# Altium project Back Row.PrjPcb
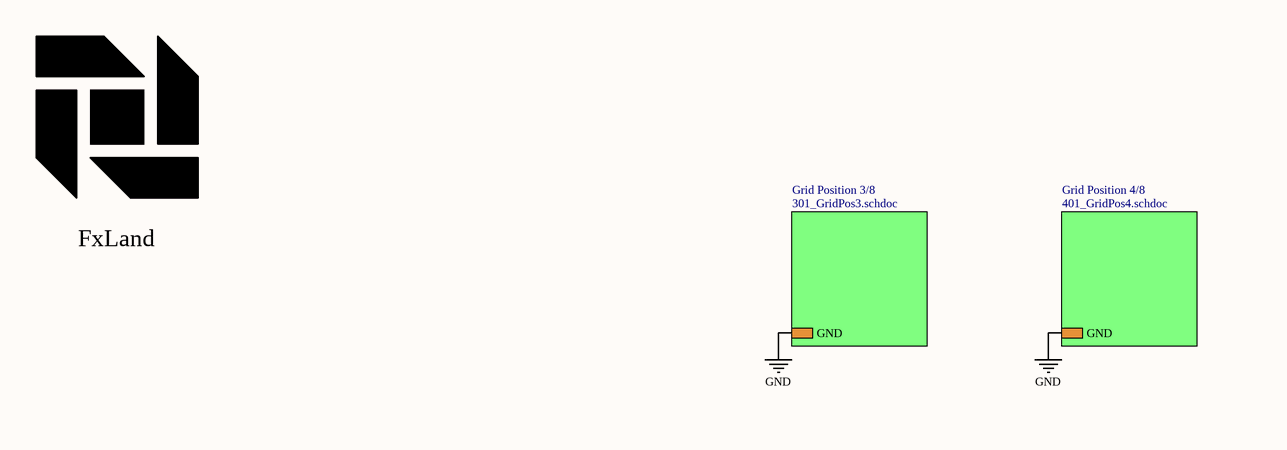
[diagram p0: 001_top.SchDoc, left]
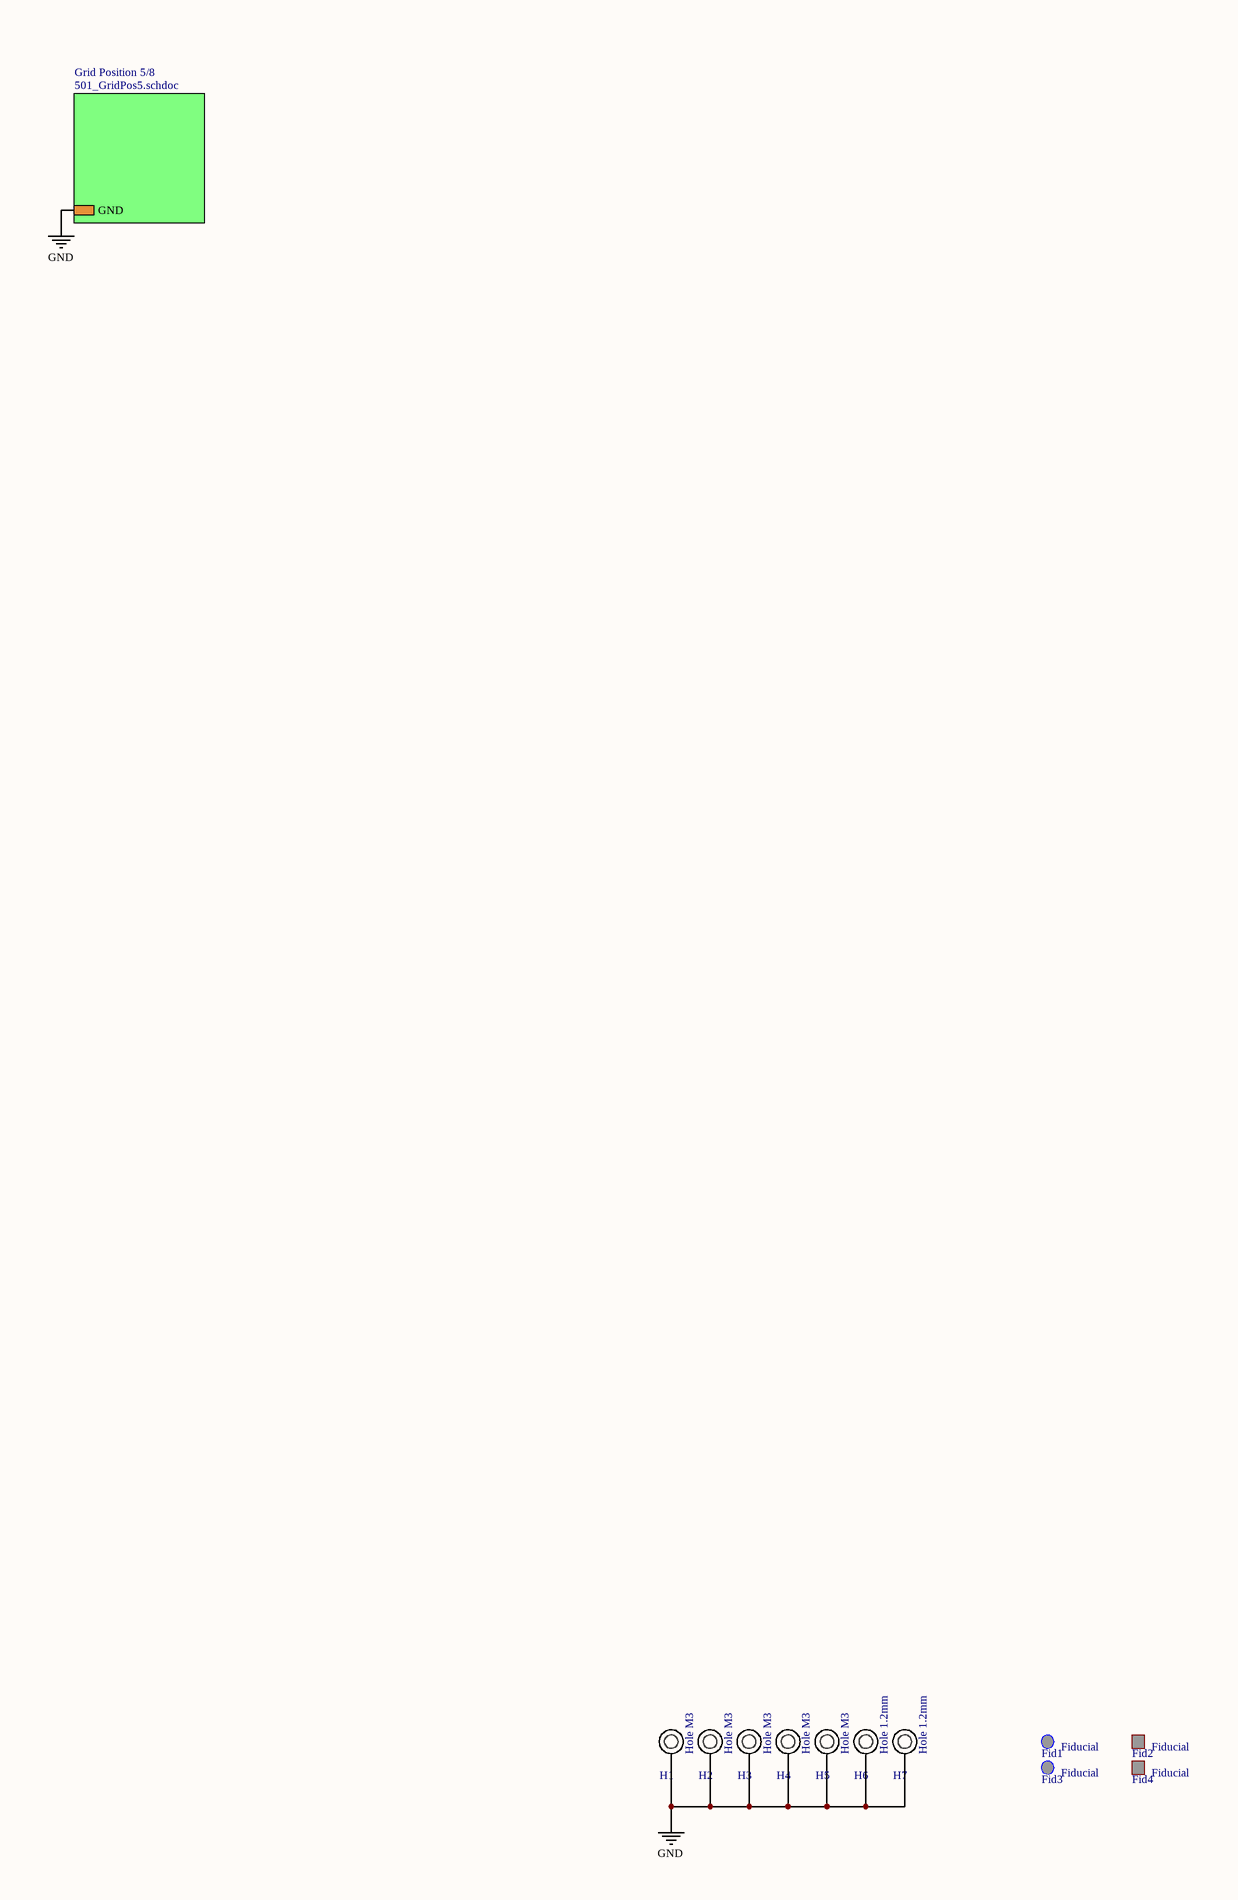
[diagram p1: 001_top.SchDoc, right]
DocNumber: P234; Rev: 1.8
4 sheets, 18 parts. Net scope: hierarchical (ports join the sheet entries above them; power ports are global).
Board file: Back Row.PcbDoc
Sheets:
  001_top.SchDoc
    Grid Position 4/8 = 401_GridPos4.SchDoc
    Grid Position 5/8 = 501_GridPos5.SchDoc
    Grid Position 3/8 = 301_GridPos3.SchDoc

## Sheet 001_top.SchDoc
size A2; Organization: Greenfield Tech Solutions; Address1: Molendreef 33; Address2: Ossendrecht; Address3: 4641CS; Address4: The Netherlands; DocumentNumber: P234; Revision: 1.8; SheetNumber: 1; SheetTotal: 4

### Parts
Fid1  Fiducial  [FidR_1.0mm]
Fid2  Fiducial  [FidS_1.0mm]
Fid3  Fiducial  [FidR_1.0mm]
Fid4  Fiducial  [FidS_1.0mm]
H1  Hole M3  [HOLE_M3]
H2  Hole M3  [HOLE_M3]
H3  Hole M3  [HOLE_M3]
H4  Hole M3  [HOLE_M3]
H5  Hole M3  [HOLE_M3]
H6  Hole 1.2mm  [HOLE_1.2MM]
H7  Hole 1.2mm  [HOLE_1.2MM]
Logo_FxLand1  FxLand  [Logo_FxLand_3]  (value not drawn)

### Sub-sheets
Grid Position 3/8 = 301_GridPos3.schdoc: GND
Grid Position 4/8 = 401_GridPos4.schdoc: GND
Grid Position 5/8 = 501_GridPos5.schdoc: GND

### Nets
GND: H1.1 H2.1 H3.1 H4.1 H5.1 H6.1 H7.1 ; sheet Grid Position 4/8/GND, sheet Grid Position 5/8/GND, sheet Grid Position 3/8/GND

### Notes on the sheet
- Title
- Size:
- Date:
- File:
- A2
- Number:
- Time:
- Revision:
- Sheet
- of

### Library data of the parts
Fid1 Fid3 = ME0011: Fiducial Round 1mm; Part Number: ME0011; ID: 11; RefVal: Fiducial
Fid2 Fid4 = ME0012: Fiducial Sqaure 1mm; Part Number: ME0012; ID: 12; RefVal: Fiducial
H1-H5 = ME0001: Mounting Hole M3; Part Number: ME0001; ID: 1; RefVal: Hole M3
H6 H7 = ME0025: Mounting Hole 1.2MM; Part Number: ME0025; ID: 25; RefVal: Hole 1.2mm
Logo_FxLand1 = ME0008: Logo FxLand 3; Part Number: ME0008; ID: 8; RefVal: FxLand

## Sheet 401_GridPos4.SchDoc
size A2; Organization: Greenfield Tech Solutions; Address1: Molendreef 33; Address2: Ossendrecht; Address3: 4641CS; Address4: The Netherlands; DocumentNumber: P234; Revision: 1.8; SheetNumber: 3; SheetTotal: 4
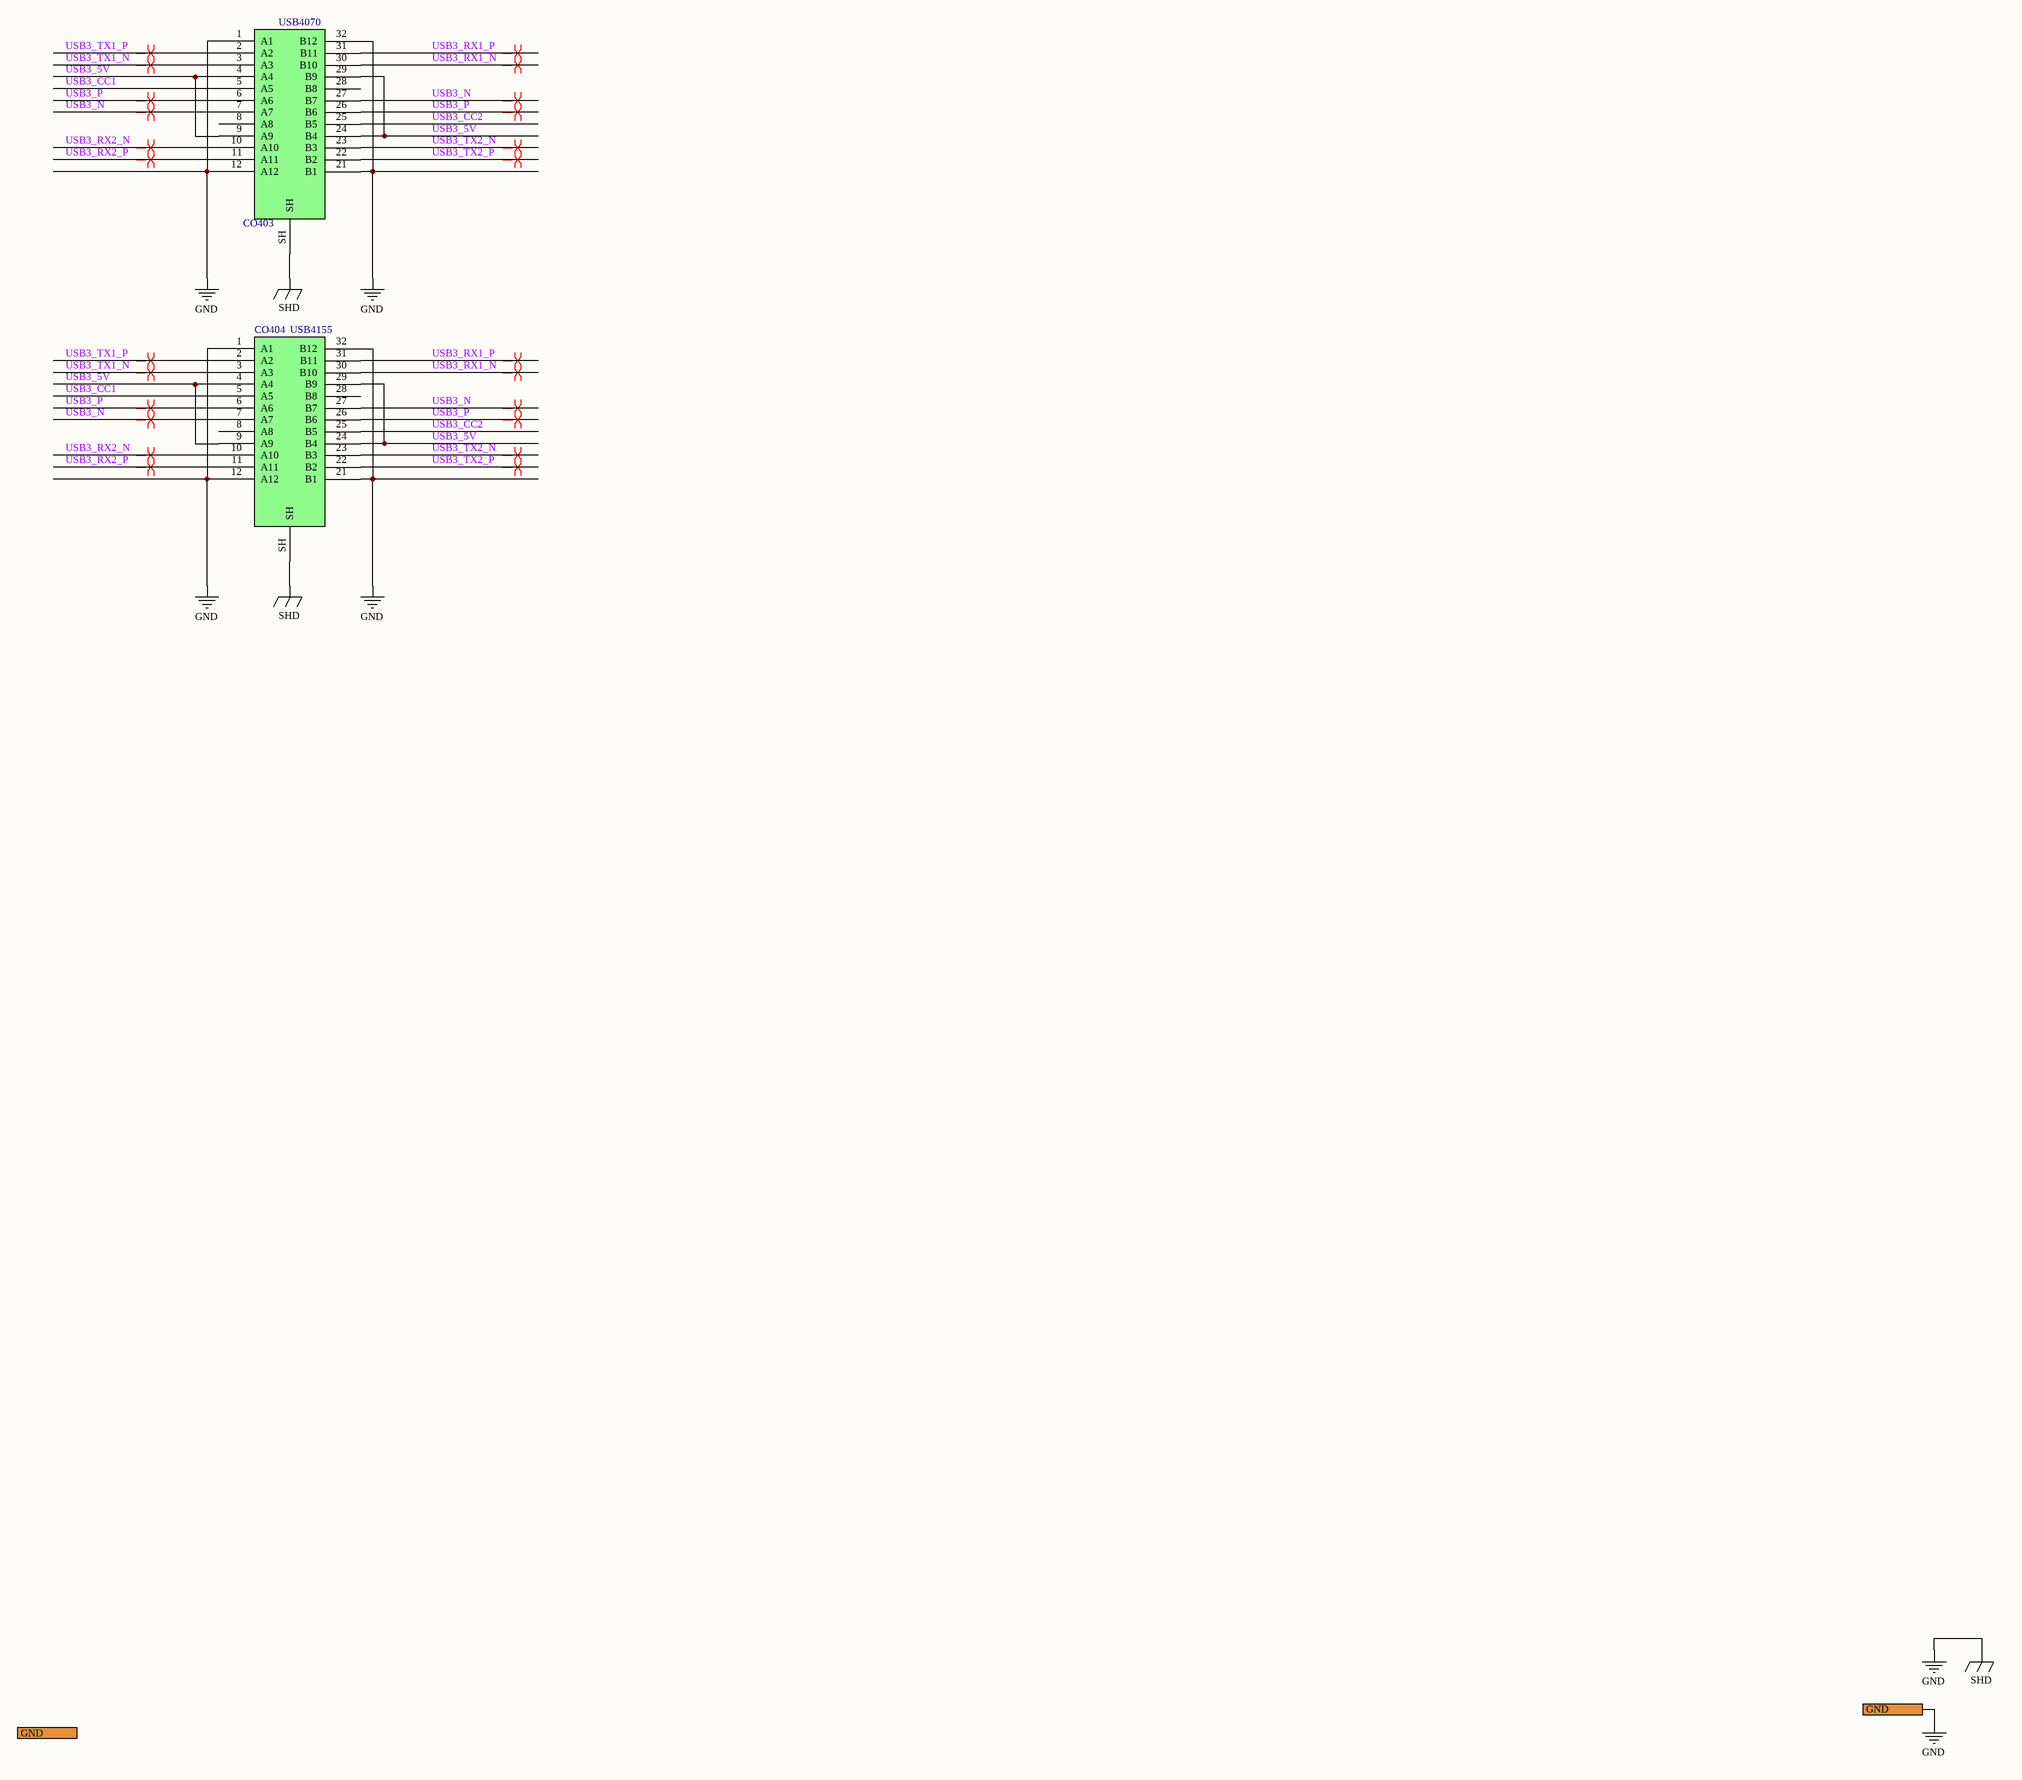
[diagram p2: 401_GridPos4.SchDoc]

### Parts
CO403  USB4070  [USB4070-30-C]
CO404  USB4155  [USB4155-03-C]

### Ports
GND

### Nets
GND: CO403.1(A1) CO403.12(A12) CO403.21(B1) CO403.32(B12) CO403.SH CO404.1(A1) CO404.12(A12) CO404.21(B1) CO404.32(B12) CO404.SH ; port GND  [also labelled SHD]
USB3_5V: CO403.4(A4) CO403.9(A9) CO403.24(B4) CO403.29(B9) CO404.4(A4) CO404.9(A9) CO404.24(B4) CO404.29(B9)
USB3_CC1: CO403.5(A5) CO404.5(A5)
USB3_CC2: CO403.25(B5) CO404.25(B5)
USB3_N: CO403.7(A7) CO403.27(B7) CO404.7(A7) CO404.27(B7)
USB3_P: CO403.6(A6) CO403.26(B6) CO404.6(A6) CO404.26(B6)
USB3_RX1_N: CO403.30(B10) CO404.30(B10)
USB3_RX1_P: CO403.31(B11) CO404.31(B11)
USB3_RX2_N: CO403.10(A10) CO404.10(A10)
USB3_RX2_P: CO403.11(A11) CO404.11(A11)
USB3_TX1_N: CO403.3(A3) CO404.3(A3)
USB3_TX1_P: CO403.2(A2) CO404.2(A2)
USB3_TX2_N: CO403.23(B3) CO404.23(B3)
USB3_TX2_P: CO403.22(B2) CO404.22(B2)

Not connected (* = marked no-connect by the designer): CO403 8(A8) 28(B8); CO404 8(A8) 28(B8)

### Layout directives
differential pair; differential pair class USB3: USB3_N, USB3_P, USB3_RX1_N, USB3_RX1_P, USB3_RX2_N, USB3_RX2_P, USB3_TX1_N, USB3_TX1_P, USB3_TX2_N, USB3_TX2_P

### Notes on the sheet
- Title
- Size:
- Date:
- File:
- A2
- Number:
- Time:
- Revision:
- Sheet
- of

### Library data of the parts
CO403 = CO0021: USB C connector Receptacle Vertical; Part Number: CO0021; ID: 16; RefVal: USB4070; ManfactPart: USB4070-30-C
CO404 = CO0031: USB C connector Plug Horizontal; Part Number: CO0031; ID: 30; RefVal: USB4155; ManfactPart: USB4155-03-C

## Sheet 501_GridPos5.SchDoc
size A2; Organization: Greenfield Tech Solutions; Address1: Molendreef 33; Address2: Ossendrecht; Address3: 4641CS; Address4: The Netherlands; DocumentNumber: P234; Revision: 1.8; SheetNumber: 4; SheetTotal: 4
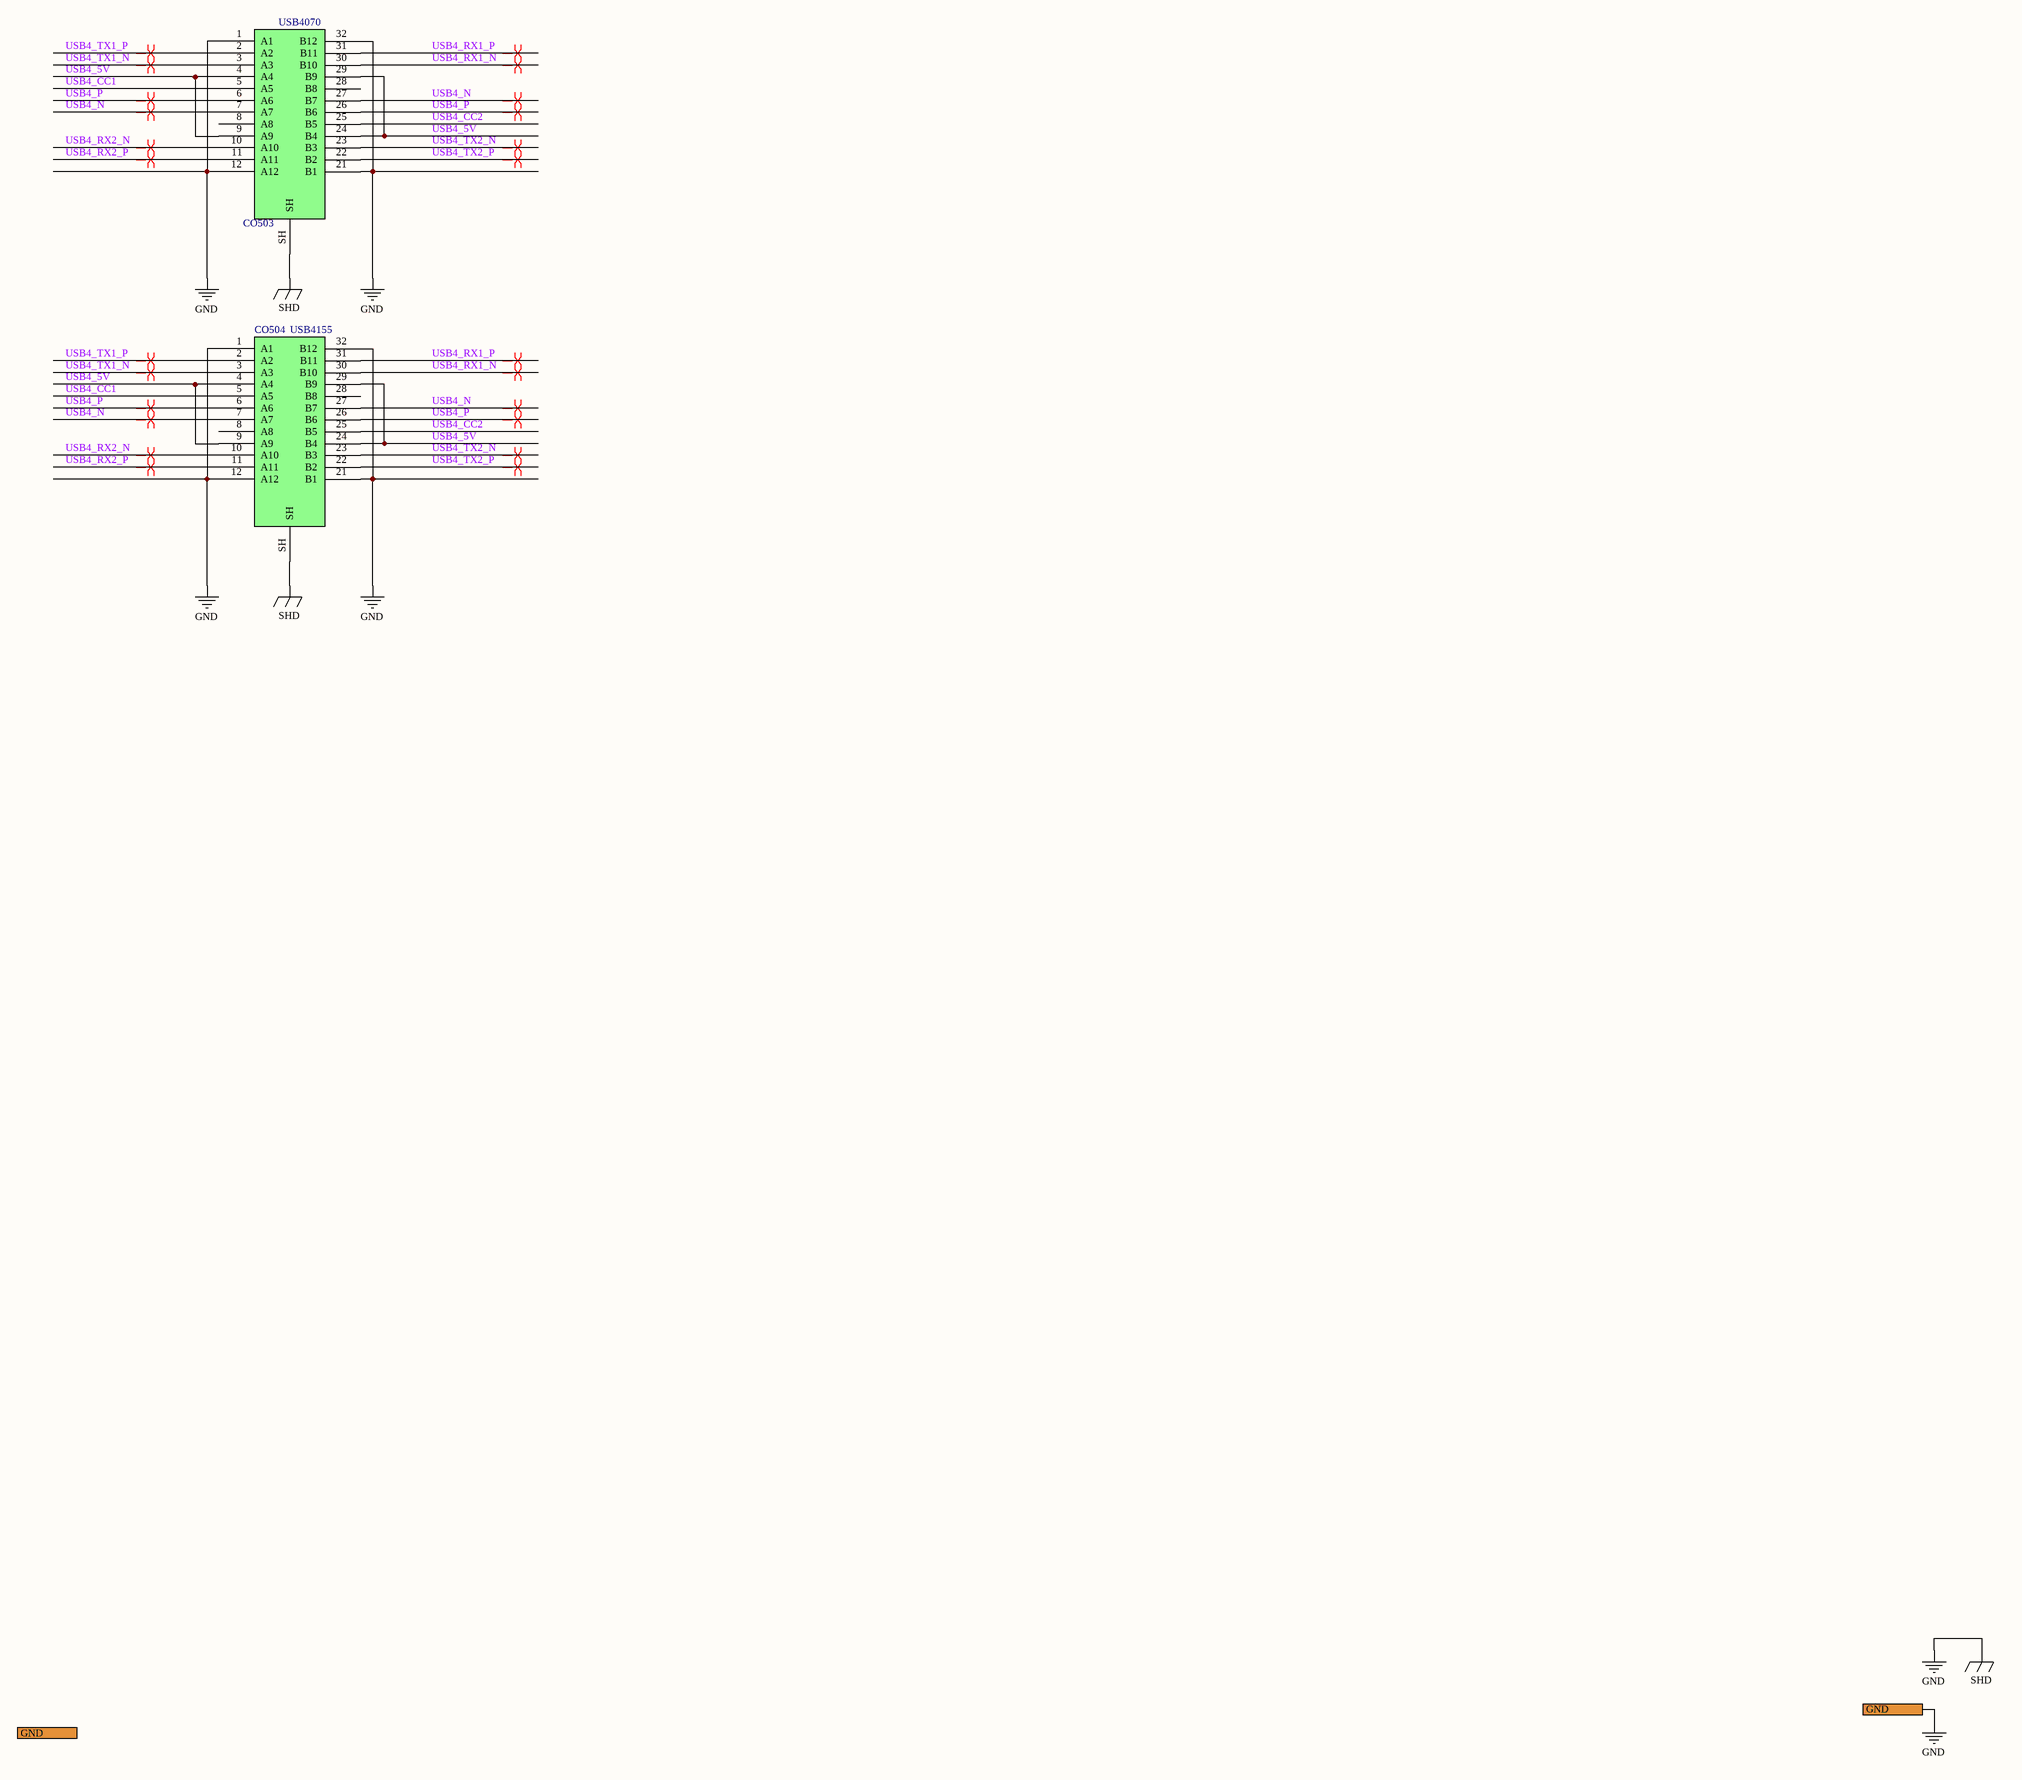
[diagram p3: 501_GridPos5.SchDoc]

### Parts
CO503  USB4070  [USB4070-30-C]
CO504  USB4155  [USB4155-03-C]

### Ports
GND

### Nets
GND: CO503.1(A1) CO503.12(A12) CO503.21(B1) CO503.32(B12) CO503.SH CO504.1(A1) CO504.12(A12) CO504.21(B1) CO504.32(B12) CO504.SH ; port GND  [also labelled SHD]
USB4_5V: CO503.4(A4) CO503.9(A9) CO503.24(B4) CO503.29(B9) CO504.4(A4) CO504.9(A9) CO504.24(B4) CO504.29(B9)
USB4_CC1: CO503.5(A5) CO504.5(A5)
USB4_CC2: CO503.25(B5) CO504.25(B5)
USB4_N: CO503.7(A7) CO503.27(B7) CO504.7(A7) CO504.27(B7)
USB4_P: CO503.6(A6) CO503.26(B6) CO504.6(A6) CO504.26(B6)
USB4_RX1_N: CO503.30(B10) CO504.30(B10)
USB4_RX1_P: CO503.31(B11) CO504.31(B11)
USB4_RX2_N: CO503.10(A10) CO504.10(A10)
USB4_RX2_P: CO503.11(A11) CO504.11(A11)
USB4_TX1_N: CO503.3(A3) CO504.3(A3)
USB4_TX1_P: CO503.2(A2) CO504.2(A2)
USB4_TX2_N: CO503.23(B3) CO504.23(B3)
USB4_TX2_P: CO503.22(B2) CO504.22(B2)

Not connected (* = marked no-connect by the designer): CO503 8(A8) 28(B8); CO504 8(A8) 28(B8)

### Layout directives
differential pair; differential pair class USB3: USB4_N, USB4_P, USB4_RX1_N, USB4_RX1_P, USB4_RX2_N, USB4_RX2_P, USB4_TX1_N, USB4_TX1_P, USB4_TX2_N, USB4_TX2_P

### Notes on the sheet
- Title
- Size:
- Date:
- File:
- A2
- Number:
- Time:
- Revision:
- Sheet
- of

### Library data of the parts
CO503 = CO0021: as CO403 on sheet 401_GridPos4; RefVal: USB4070; ManfactPart: USB4070-30-C
CO504 = CO0031: as CO404 on sheet 401_GridPos4; RefVal: USB4155; ManfactPart: USB4155-03-C

## Sheet 301_GridPos3.SchDoc
size A2; Organization: Greenfield Tech Solutions; Address1: Molendreef 33; Address2: Ossendrecht; Address3: 4641CS; Address4: The Netherlands; DocumentNumber: P234; Revision: 1.8; SheetNumber: 2; SheetTotal: 4
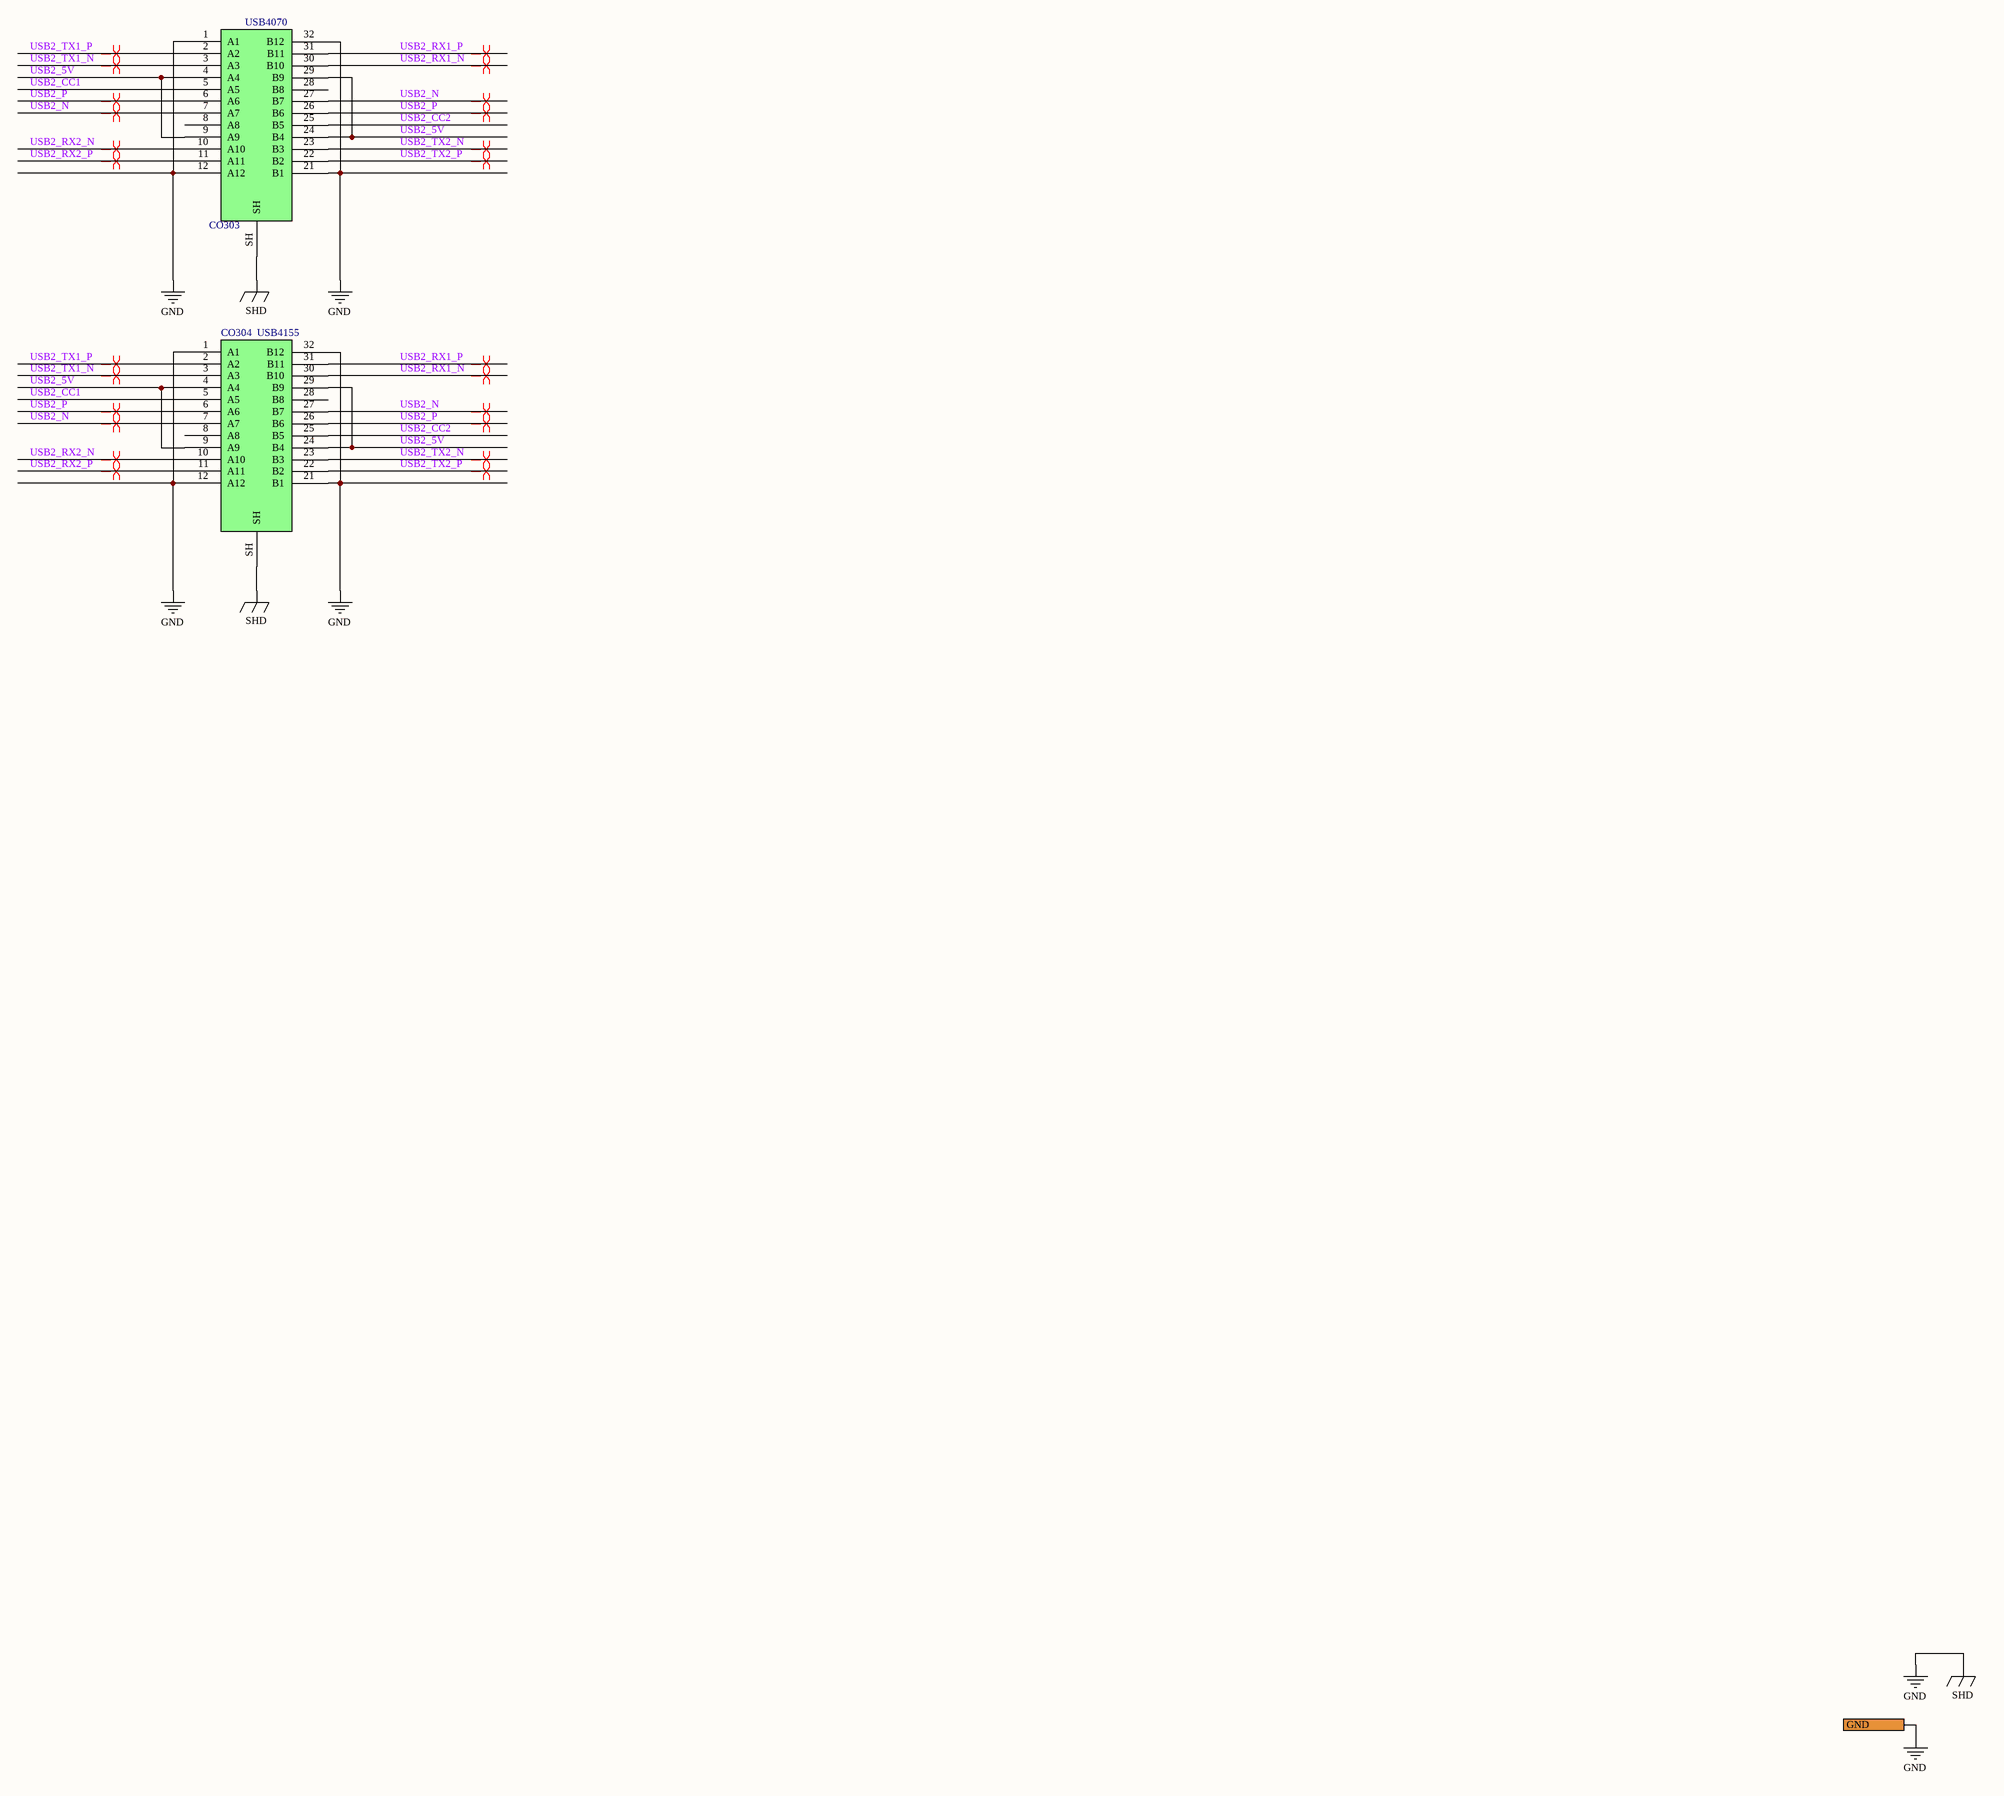
[diagram p4: 301_GridPos3.SchDoc]

### Parts
CO303  USB4070  [USB4070-30-C]
CO304  USB4155  [USB4155-03-C]

### Ports
GND

### Nets
GND: CO303.1(A1) CO303.12(A12) CO303.21(B1) CO303.32(B12) CO303.SH CO304.1(A1) CO304.12(A12) CO304.21(B1) CO304.32(B12) CO304.SH ; port GND  [also labelled SHD]
USB2_5V: CO303.4(A4) CO303.9(A9) CO303.24(B4) CO303.29(B9) CO304.4(A4) CO304.9(A9) CO304.24(B4) CO304.29(B9)
USB2_CC1: CO303.5(A5) CO304.5(A5)
USB2_CC2: CO303.25(B5) CO304.25(B5)
USB2_N: CO303.7(A7) CO303.27(B7) CO304.7(A7) CO304.27(B7)
USB2_P: CO303.6(A6) CO303.26(B6) CO304.6(A6) CO304.26(B6)
USB2_RX1_N: CO303.30(B10) CO304.30(B10)
USB2_RX1_P: CO303.31(B11) CO304.31(B11)
USB2_RX2_N: CO303.10(A10) CO304.10(A10)
USB2_RX2_P: CO303.11(A11) CO304.11(A11)
USB2_TX1_N: CO303.3(A3) CO304.3(A3)
USB2_TX1_P: CO303.2(A2) CO304.2(A2)
USB2_TX2_N: CO303.23(B3) CO304.23(B3)
USB2_TX2_P: CO303.22(B2) CO304.22(B2)

Not connected (* = marked no-connect by the designer): CO303 8(A8) 28(B8); CO304 8(A8) 28(B8)

### Layout directives
differential pair; differential pair class USB3: USB2_N, USB2_P, USB2_RX1_N, USB2_RX1_P, USB2_RX2_N, USB2_RX2_P, USB2_TX1_N, USB2_TX1_P, USB2_TX2_N, USB2_TX2_P

### Notes on the sheet
- Title
- Size:
- Date:
- File:
- A2
- Number:
- Time:
- Revision:
- Sheet
- of

### Library data of the parts
CO303 = CO0021: as CO403 on sheet 401_GridPos4; RefVal: USB4070; ManfactPart: USB4070-30-C
CO304 = CO0031: as CO404 on sheet 401_GridPos4; RefVal: USB4155; ManfactPart: USB4155-03-C

## Nets that join several sheets
GND: 001_top (7 pins), 401_GridPos4 (10 pins), 501_GridPos5 (10 pins), 301_GridPos3 (10 pins)